# Altium schematic sheet 2_AT_START_F403A_V1.2_MCU.SchDoc
size A4
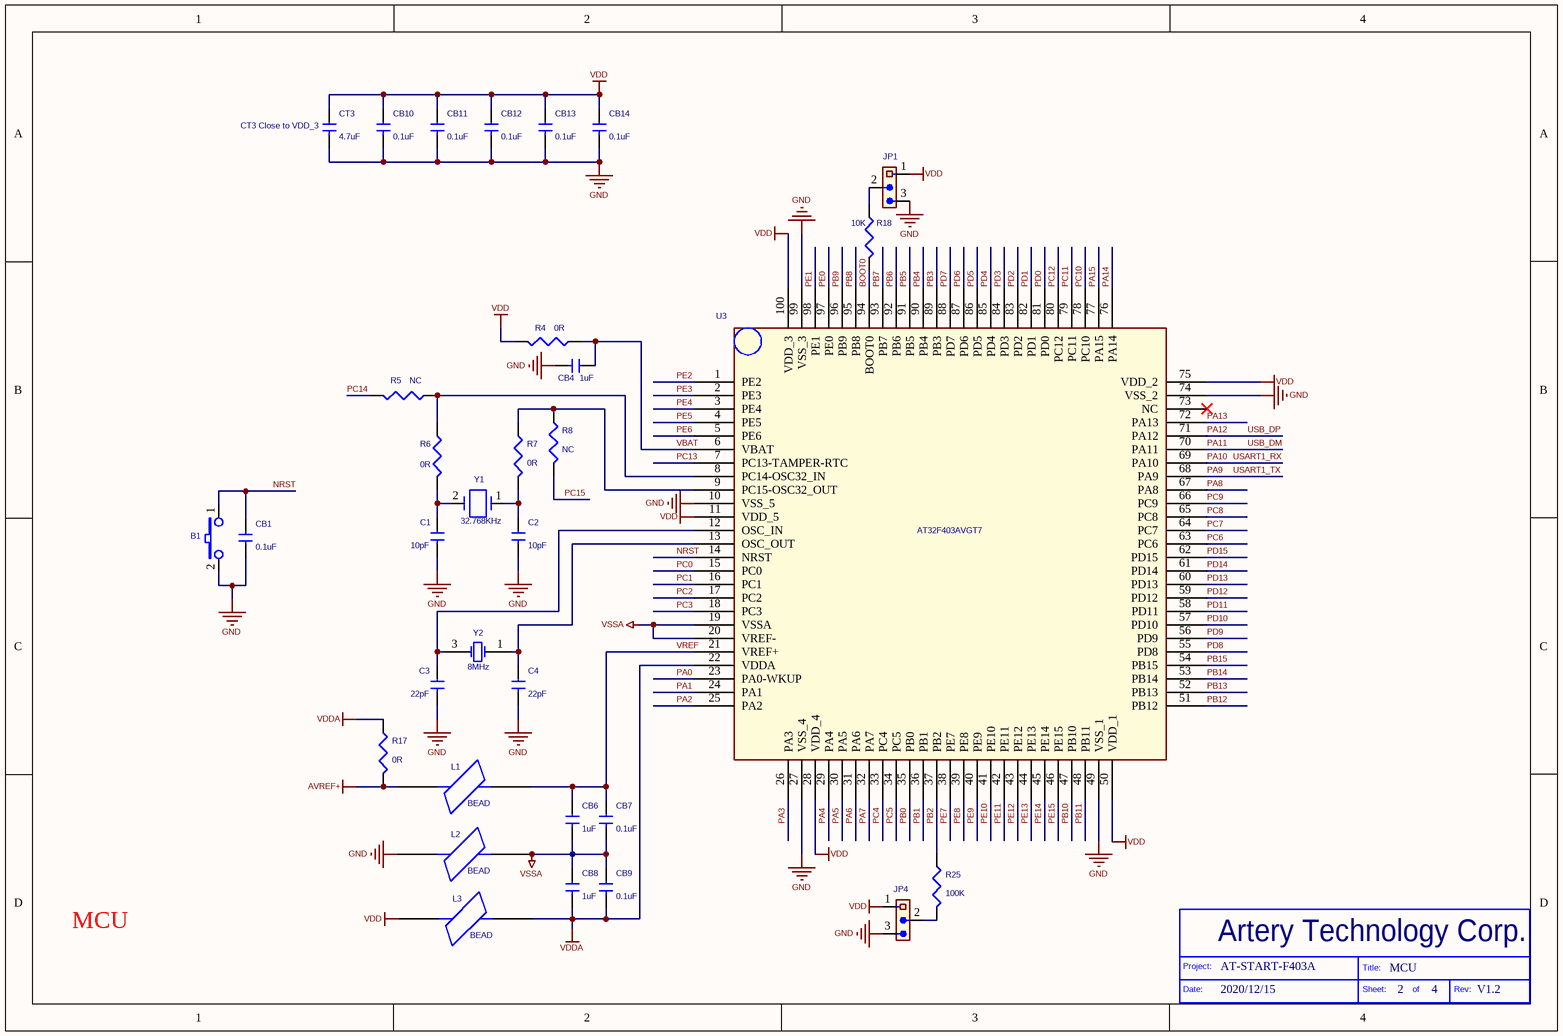
[diagram p0: 2_AT_START_F403A_V1.2_MCU.SchDoc]

## Parts
B1  PB,BLACK,SMD_2P  [KEY_SOP_6*6]  (value not drawn)
C1  10pF  [C0603]
C2  10pF  [C0603]
C3  22pF  [C0603]
C4  22pF  [C0603]
CB1  0.1uF  [C0603]
CB4  1uF  [C0603]
CB6  1uF  [C0603]
CB7  0.1uF  [C0603]
CB8  1uF  [C0603]
CB9  0.1uF  [C0603]
CB10  0.1uF  [C0603]
CB11  0.1uF  [C0603]
CB12  0.1uF  [C0603]
CB13  0.1uF  [C0603]
CB14  0.1uF  [C0603]
CT3  4.7uF  [C0603]
JP1  1X3P_2.54M  [HDR1X3]  (value not drawn)
JP4  1X3P_2.54M  [HDR1X3]  (value not drawn)
L1  BEAD  [R0603]
L2  BEAD  [R0603]
L3  BEAD  [R0603]
R4  0R  [SB-PAD]
R5  NC  [SB-PAD]
R6  0R  [SB-PAD]
R7  0R  [SB-PAD]
R8  NC  [SB-PAD]
R17  0R  [SB-PAD]
R18  10K  [R0603]
R25  100K  [R0603]
U3  AT32F403AVGT7  [LQFP100_14*14]
Y1  32.768KHz  [XTAL_SOP - FC-12M]
Y2  8MHz  [SMD_5032_4P]

## Nets
AVREF+: L1.1 R17.2
GND: B1.2 C1.2 C2.2 C3.2 C4.2 CB1.2 CB4.2 CB10.2 CB11.2 CB12.2 CB13.2 CB14.2 CT3.2 JP1.3 JP4.3 L2.1 U3.10(VSS_5) U3.27(VSS_4) U3.49(VSS_1) U3.74(VSS_2) U3.99(VSS_3)
VDD: CB10.1 CB11.1 CB12.1 CB13.1 CB14.1 CT3.1 JP1.1 JP4.1 L3.1 R4.2 U3.11(VDD_5) U3.28(VDD_4) U3.50(VDD_1) U3.75(VDD_2) U3.100(VDD_3)
VDDA: CB8.2 CB9.2 L3.2 R17.1 U3.22(VDDA)
VSSA: CB6.2 CB7.2 CB8.1 CB9.1 L2.2 U3.19(VSSA) U3.20(VREF-)
BOOT0: R18.2 U3.94(BOOT0)
NRST: B1.1 CB1.1 U3.14(NRST)
PA0: U3.23(PA0-WKUP)
PA1: U3.24(PA1)
PA2: U3.25(PA2)
PA3: U3.26(PA3)
PA4: U3.29(PA4)
PA5: U3.30(PA5)
PA6: U3.31(PA6)
PA7: U3.32(PA7)
PA8: U3.67(PA8)
PA9: U3.68(PA9)  [also labelled USART1_TX]
PA10: U3.69(PA10)  [also labelled USART1_RX]
PA11: U3.70(PA11)  [also labelled USB_DM]
PA12: U3.71(PA12)  [also labelled USB_DP]
PA13: U3.72(PA13)
PA14: U3.76(PA14)
PA15: U3.77(PA15)
PB0: U3.35(PB0)
PB1: U3.36(PB1)
PB2: R25.1 U3.37(PB2)
PB3: U3.89(PB3)
PB4: U3.90(PB4)
PB5: U3.91(PB5)
PB6: U3.92(PB6)
PB7: U3.93(PB7)
PB8: U3.95(PB8)
PB9: U3.96(PB9)
PB10: U3.47(PB10)
PB11: U3.48(PB11)
PB12: U3.51(PB12)
PB13: U3.52(PB13)
PB14: U3.53(PB14)
PB15: U3.54(PB15)
PC0: U3.15(PC0)
PC1: U3.16(PC1)
PC2: U3.17(PC2)
PC3: U3.18(PC3)
PC4: U3.33(PC4)
PC5: U3.34(PC5)
PC6: U3.63(PC6)
PC7: U3.64(PC7)
PC8: U3.65(PC8)
PC9: U3.66(PC9)
PC10: U3.78(PC10)
PC11: U3.79(PC11)
PC12: U3.80(PC12)
PC13: U3.7(PC13-TAMPER-RTC)
PC14: R5.2
PC15: R8.2
PD0: U3.81(PD0)
PD1: U3.82(PD1)
PD2: U3.83(PD2)
PD3: U3.84(PD3)
PD4: U3.85(PD4)
PD5: U3.86(PD5)
PD6: U3.87(PD6)
PD7: U3.88(PD7)
PD8: U3.55(PD8)
PD9: U3.56(PD9)
PD10: U3.57(PD10)
PD11: U3.58(PD11)
PD12: U3.59(PD12)
PD13: U3.60(PD13)
PD14: U3.61(PD14)
PD15: U3.62(PD15)
PE0: U3.97(PE0)
PE1: U3.98(PE1)
PE2: U3.1(PE2)
PE3: U3.2(PE3)
PE4: U3.3(PE4)
PE5: U3.4(PE5)
PE6: U3.5(PE6)
PE7: U3.38(PE7)
PE8: U3.39(PE8)
PE9: U3.40(PE9)
PE10: U3.41(PE10)
PE11: U3.42(PE11)
PE12: U3.43(PE12)
PE13: U3.44(PE13)
PE14: U3.45(PE14)
PE15: U3.46(PE15)
VBAT: CB4.1 R4.1 U3.6(VBAT)
VREF: CB6.1 CB7.1 L1.2 U3.21(VREF+)
NetC1_1: C1.1 R6.2 Y1.2
NetC2_1: C2.1 R7.2 Y1.1
NetC3_1: C3.1 U3.12(OSC_IN) Y2.3(OSC2)
NetC4_1: C4.1 U3.13(OSC_OUT) Y2.1(OSC1)
NetJP1_2: JP1.2 R18.1
NetJP4_2: JP4.2 R25.2
NetR5_1: R5.1 R6.1 U3.8(PC14-OSC32_IN)
NetR7_1: R7.1 R8.1 U3.9(PC15-OSC32_OUT)

Not connected (* = marked no-connect by the designer): U3 73(NC)*

## Notes on the sheet
- (near CT3) CT3 Close to VDD_3
- MCU
- AT-START-F403A
- 2020/12/15
- 2
- 4
- V1.2
- Project:
- Date:
- Artery Technology Corp.
- Title:
- Sheet:
- of
- Rev:

## Library data of the parts
B1 = Push_Bottom,Blue,SMD_2P
C1-C4 = 10pF,50V,5%,SMD0603
CB1 CB4 CB6-CB9 = 0.1uF,50V,20%,SMD0603
CB10-CB14 CT3 = 0.1uF,25V,20%,SMD0402
JP1 JP4 = 1X3P,Male,DIP_2.54
R4 R17 = 470,1/10W,1%,SMD0603
R5-R8 = 0,1/10W,1%,SMD0603
R18 R25 = 10K,1/10W,1%,SMD0603
U3 = LQFP100
Y1 = 32.768KHz,CRY,30PPM,Size_3X8: FC-12M 2012 EPSON
Y2 = SMD-5032_4P  8MHZ 20PF 10PPM: ?片晶振; ComponentLink1Description: 供?商?接; ComponentLink1URL: http://www.szlcsc.com/product/details_9522.html; Package: SMD-3225_4P; Supplier: LC; SuppliersPartNumber: C9002